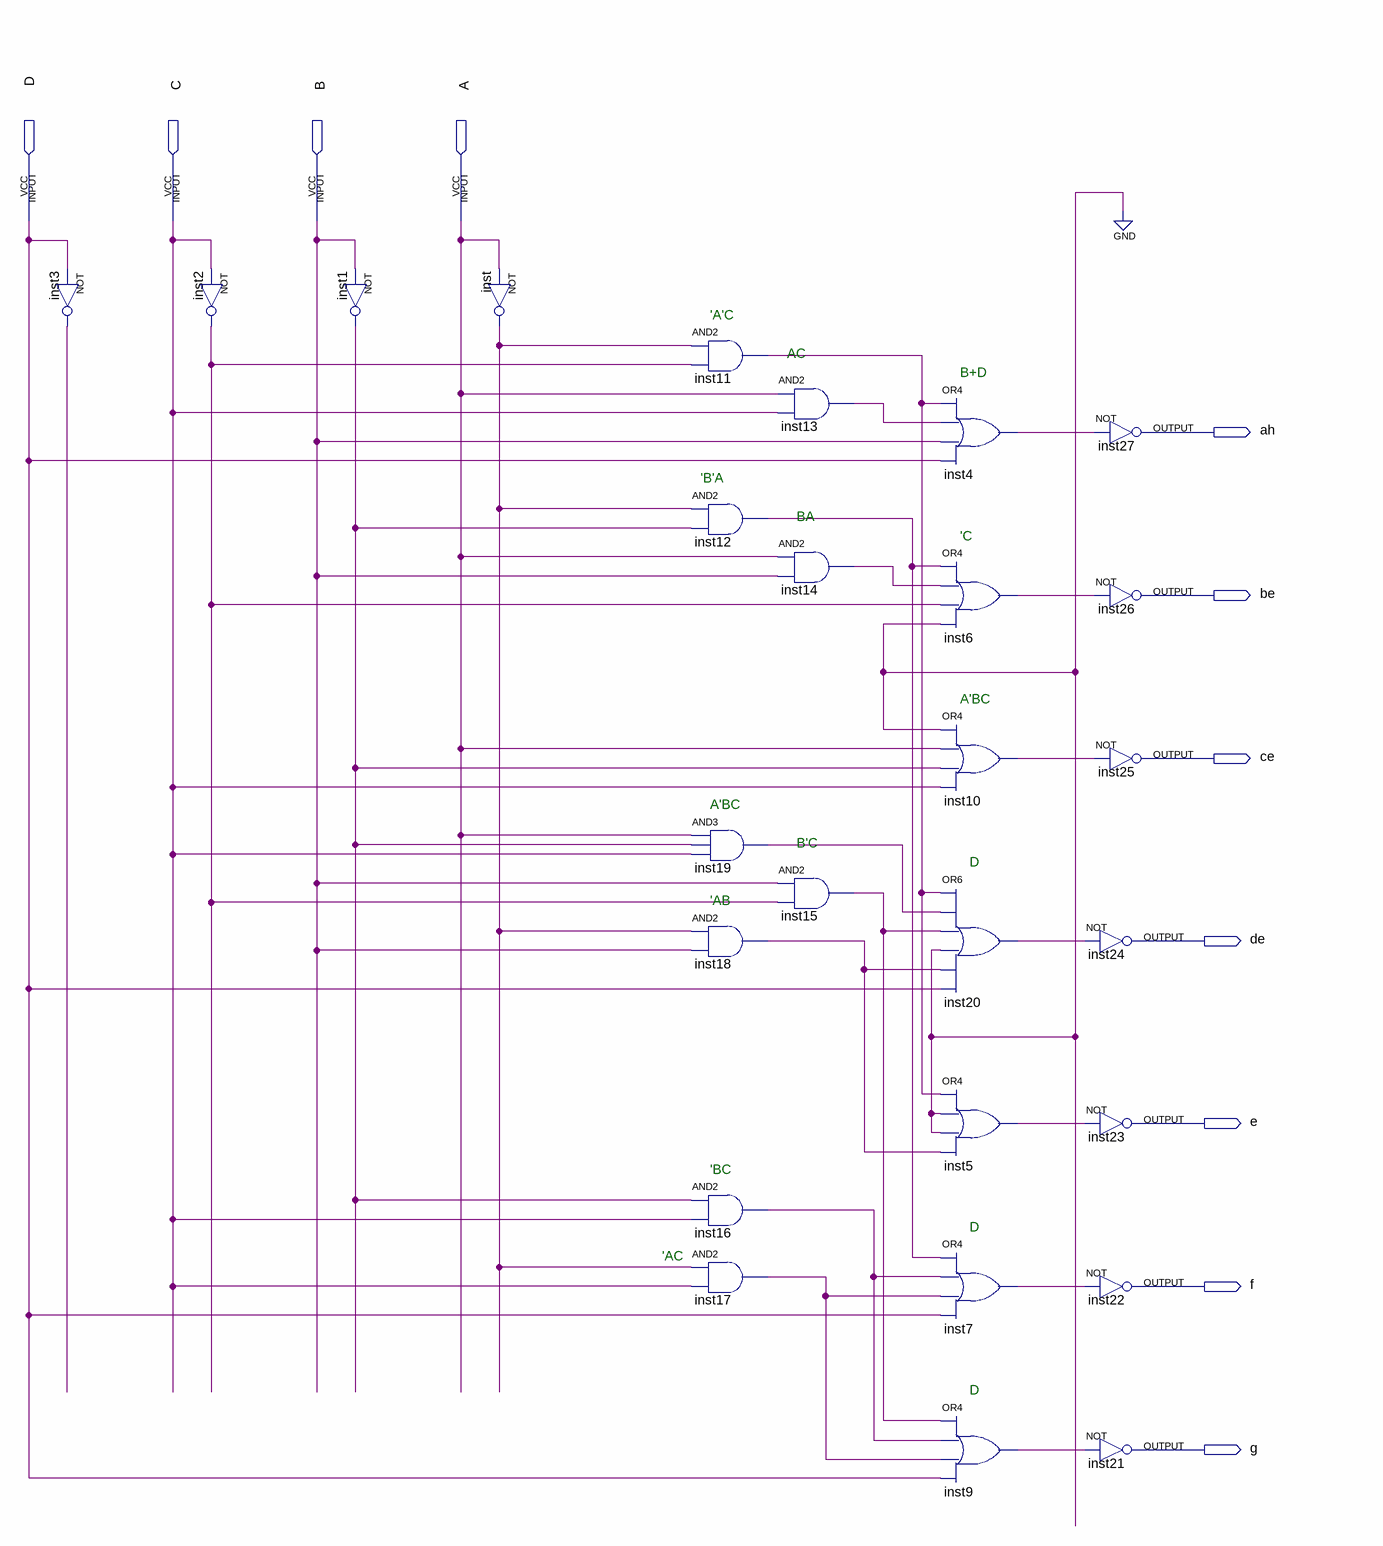
[diagram p0: schematic sheet]
// Quartus schematic decoder0a9.bdf as structural Verilog: 27 symbols, 11 pins
module decoder0a9 (
  input  D,
  input  C,
  input  B,
  input  A,
  output ah,
  output be,
  output ce,
  output de,
  output e,
  output f,
  output g
);

  wire inst1_out, inst2_out, inst3_out, inst4_out, inst5_out, inst6_out, inst7_out, inst9_out, inst10_out,
       inst11_out, inst12_out, inst13_out, inst14_out, inst15_out, inst16_out, inst17_out, inst18_out,
       inst19_out, inst20_out, inst_out;

  not inst3 (inst3_out, D);
  not inst2 (inst2_out, C);
  not inst1 (inst1_out, B);
  not inst (inst_out, A);
  and inst11 (inst11_out, inst_out, inst2_out);
  and inst12 (inst12_out, inst_out, inst1_out);
  and inst19 (inst19_out, A, inst1_out, C);
  and inst18 (inst18_out, inst_out, B);
  and inst16 (inst16_out, inst1_out, C);
  and inst17 (inst17_out, inst_out, C);
  and inst13 (inst13_out, A, C);
  and inst14 (inst14_out, A, B);
  and inst15 (inst15_out, B, inst2_out);
  or inst4 (inst4_out, inst11_out, inst13_out, B, D);
  or inst6 (inst6_out, inst12_out, inst14_out, inst2_out, 1'b0);
  or inst10 (inst10_out, 1'b0, A, inst1_out, C);
  or inst20 (inst20_out, inst11_out, inst19_out, inst15_out, 1'b0, inst18_out, D);
  or inst5 (inst5_out, inst11_out, 1'b0, 1'b0, inst18_out);
  or inst7 (inst7_out, inst12_out, inst16_out, inst17_out, D);
  or inst9 (inst9_out, inst15_out, inst16_out, inst17_out, D);
  not inst27 (ah, inst4_out);
  not inst26 (be, inst6_out);
  not inst25 (ce, inst10_out);
  not inst24 (de, inst20_out);
  not inst23 (e, inst5_out);
  not inst22 (f, inst7_out);
  not inst21 (g, inst9_out);

  // Notes on the sheet:
  //   'A'C
  //   AC
  //   B+D
  //   'B'A
  //   BA
  //   'C
  //   A'BC
  //   A'BC
  //   B'C
  //   D
  //   'AB
  //   'BC
  //   D
  //   'AC
  //   D
endmodule
